# EAGLE design GPS Shield 2.0 (EAGLE 5.11)
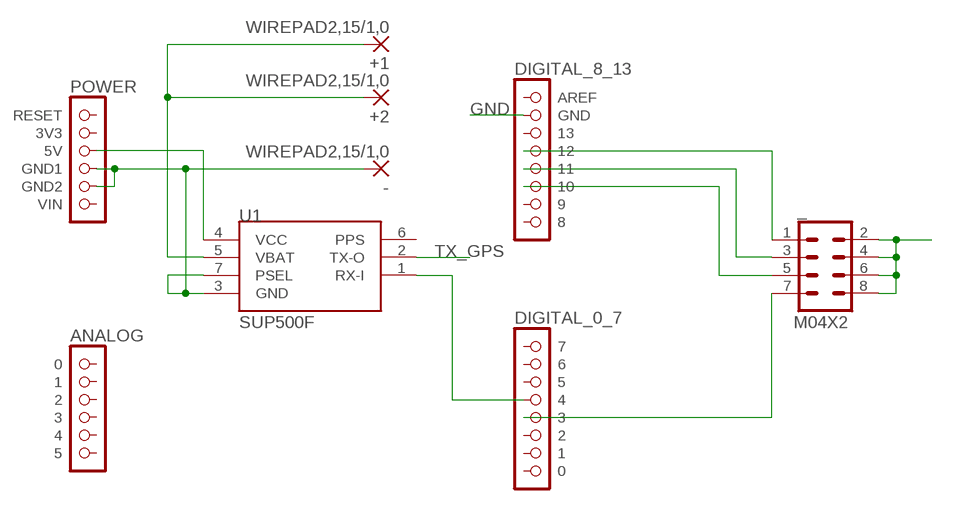
[diagram p0: schematic, sheet 1]

## Parts
+1  WIREPAD2,15/1,0  [2,15/1,0]
+2  WIREPAD2,15/1,0  [2,15/1,0]
-  WIREPAD2,15/1,0  [2,15/1,0]
_  M04X2  [2X4]
U1  SUP500F  [SUP500F]
U$1  POWER  [1X06]
U$2  ANALOG  [1X06]
U$3  DIGITAL_0_7  [1X08]
U$4  DIGITAL_8_13  [1X08]

## Nets
5V: U1.4(VCC) U$1.3(5V)
GND: -.1(P) U1.3(GND) U1.7(PSEL) U$1.4(GND1) U$1.5(GND2) U$4.2(GND)
N$2: U1.1(RX-I) U$3.4
N$5: +1.1(P) +2.1(P) U1.5(VBAT)
TO3: _.7 U$3.5
TO10: _.5 U$4.6
TO11: _.3 U$4.5
TO12: _.1 U$4.4
TX_GPS: _.2 _.4 _.6 _.8 U1.2(TX-O)
Unconnected: U1.6(PPS) U$1.1(RESET) U$1.2(3V3) U$1.6(VIN) U$2.1 U$2.2 U$2.3 U$2.4 U$2.5 U$2.6 U$3.1 U$3.2 U$3.3 U$3.6 U$3.7 U$3.8 U$4.1(AREF) U$4.3 U$4.7 U$4.8

## Library data of the parts
+1 +2 - = wirepad:WIREPAD: Wire PAD connect wire on PCB
_ = SparkFun-f115009:M04X2
U1 = SparkFun:SUP500F: SUP500F Venus GPS
U$1 = arduino:POWER
U$2 = arduino:ANALOG
U$3 = arduino:DIGITAL_0_7
U$4 = arduino:DIGITAL_8_13

## Board
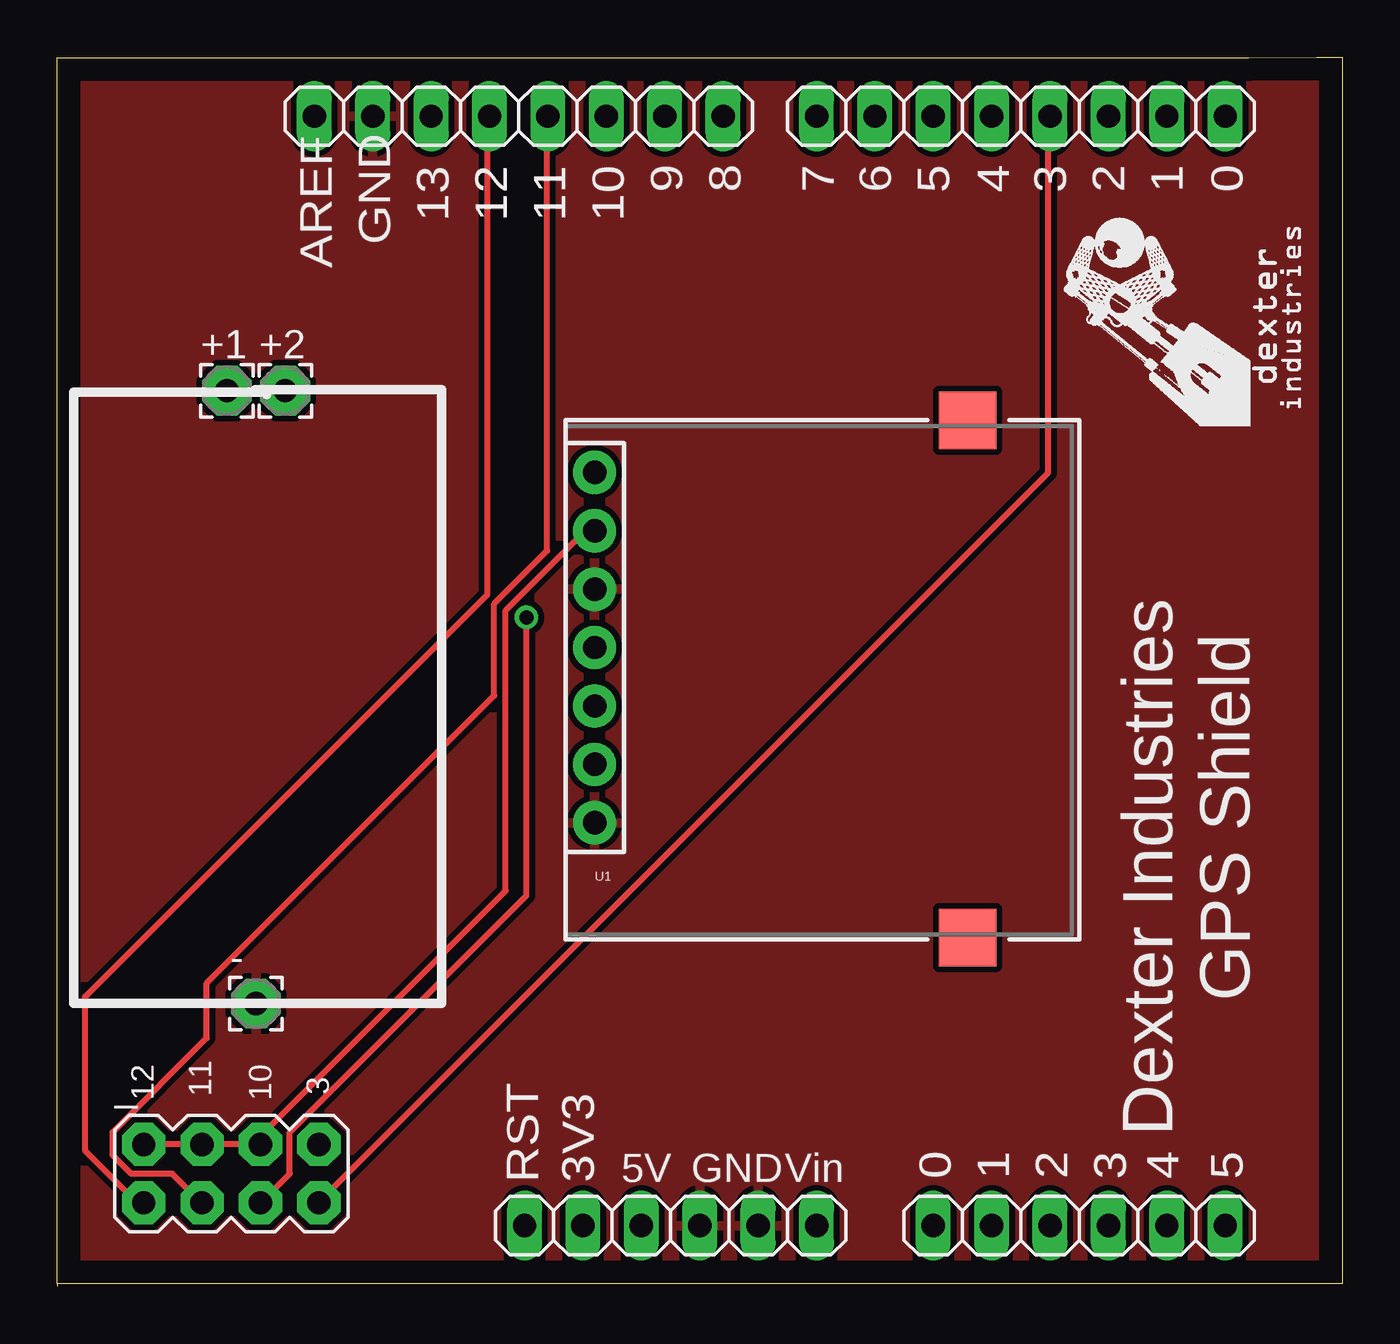
[diagram p1: board, top side]
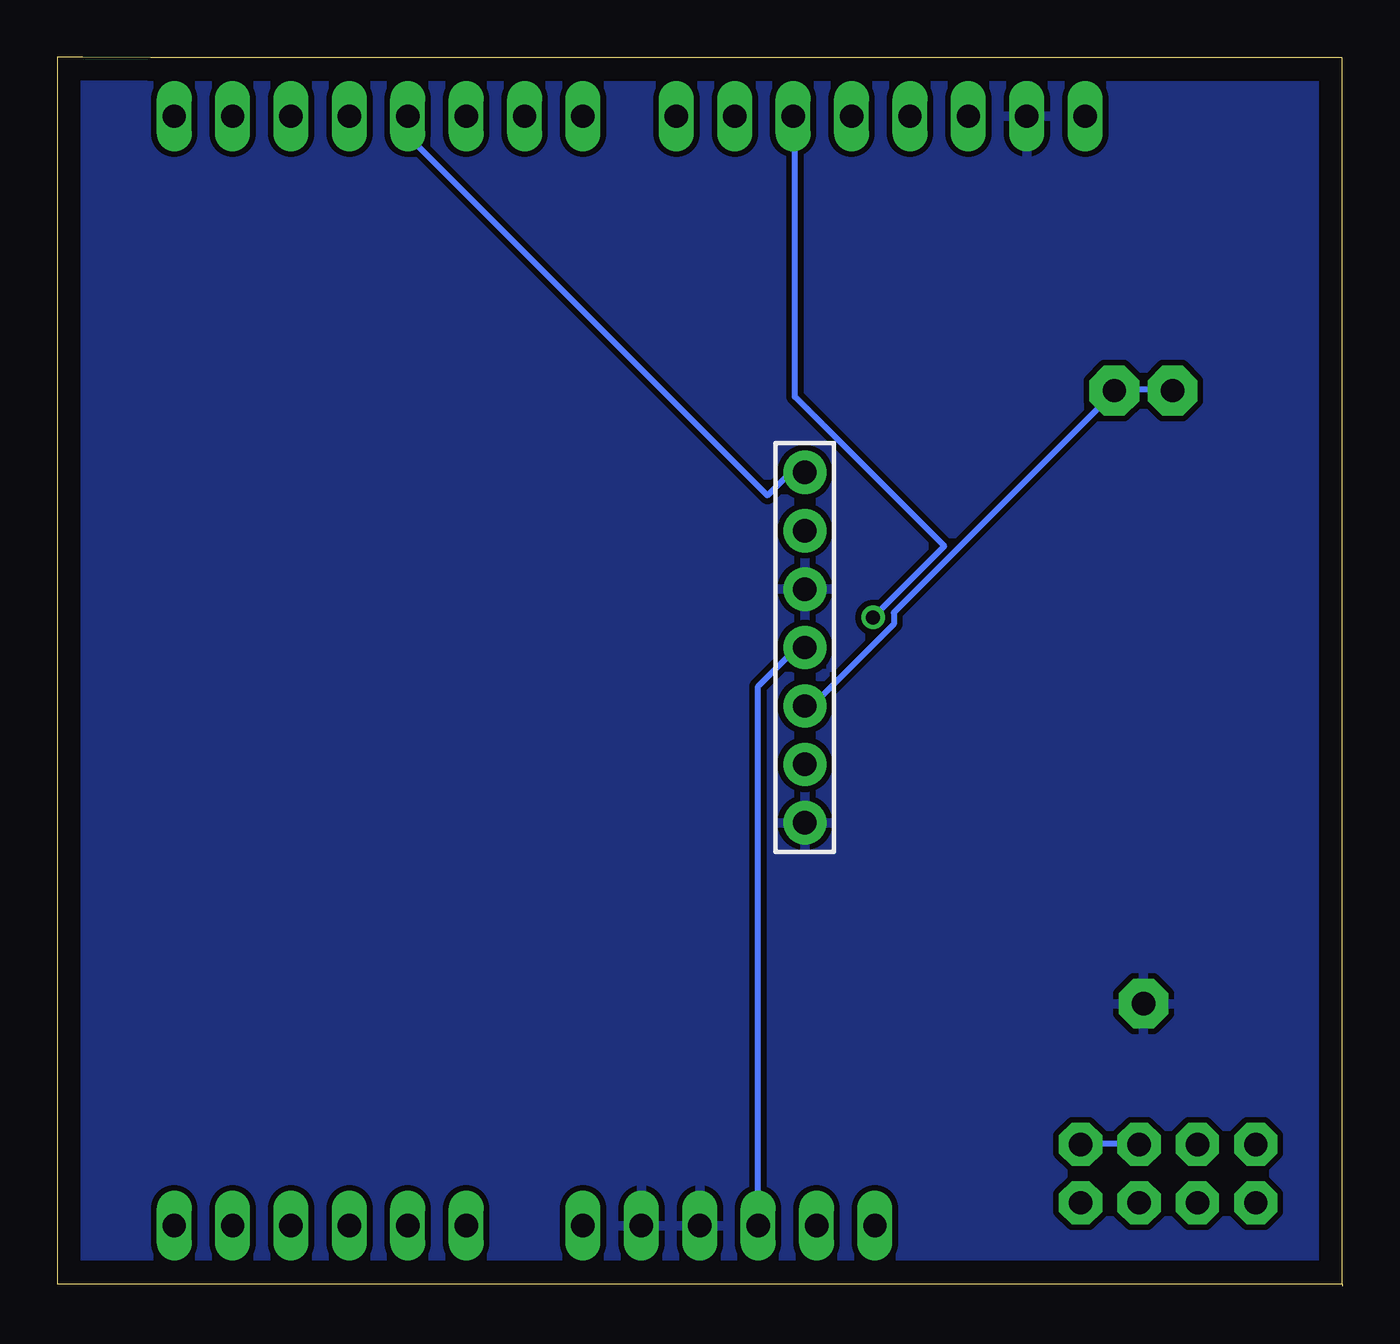
[diagram p2: board, bottom side, seen from below]

Size 55.88 x 53.46 mm. Coordinates in mm from the lower left corner, seen from the top.
Outline: 0,53.34 0,53.44
Outline: 0,53.44 51.82,53.44 54.78,53.46 55.88,53.46 55.88,0.1 0,0.1
Outline: 0,0.1 0,0
Outline: 0,0.1 0,53.34
Outline: 0,0.1 0,53.34
Outline: 0,53.34 0,53.44
Copper layers (1*16): Top 0.035mm / dielectric 1.5mm / Bottom 0.035mm
Design rules "default": minimum track width 10mil, minimum drill 24mil, track to track 8mil, track to pad 8mil, pad to pad 8mil, via to via 8mil, smd to smd 8mil, copper to edge 40mil, drill to drill 8mil, minimum pad ring 10mil, minimum via ring 8mil, stop-mask expansion 4mil, vias tented up to drill 0mil, thermal gap 10mil

### Footprints (pad centres in the part's own frame; a part is rotated, then mirrored left to right if it is on the bottom)
2,15/1,0 = drill 1.016 pad 2.159 octagon: 1 0,0
2X4 = drill 1.016 pad 1.88 octagon: 1 -3.81,-1.27; 2 -3.81,1.27; 3 -1.27,-1.27; 4 -1.27,1.27; 5 1.27,-1.27; 6 1.27,1.27; 7 3.81,-1.27; 8 3.81,1.27
SUP500F = drill 1.016 pad 1.88 round: 1 0,15.24; 2 0,12.7; 3 0,10.16; 4 0,7.62; 5 0,5.08; 6 0,2.54; 7 0,0 | smd 2.5 x 2.5: NC@0 16.22,-5; NC@1 16.22,17.51
1X06 = drill 1.016 long: 1 -6.35,0; 2 -3.81,0; 3 -1.27,0; 4 1.27,0; 5 3.81,0; 6 6.35,0
1X08 = drill 1.016 long: 1 -8.89,0; 2 -6.35,0; 3 -3.81,0; 4 -1.27,0; 5 1.27,0; 6 3.81,0; 7 6.35,0; 8 8.89,0

### Placement (x,y rotation side)
+1  7.37,38.96 0 top
+2  9.91,38.96 0 top
-  8.64,12.29 0 top
_  7.56,4.9 0 top
U1  23.37,20.17 0 top
U$1  26.67,2.64 0 top
U$2  44.45,2.64 0 top
U$3  41.91,50.9 0 top
U$4  20.07,50.9 0 top

### Tracks (layer width: path | path; a pad name or v marks a point on that pad's centre or on a via)
5V
  Bottom 0.254: U$1.3 25.4,26.1 24.1,27.4 23.7,27.4 23.4,27.7 U1.4
GND
  pour Bottom (isolate 0.254): 0.86,53.15 55.52,53.14 55.52,0.3 0.51,0.3 0.51,53.14
  pour Top (isolate 0.254): 0.69,52.87 55.36,52.87 55.36,0.48 0.69,0.48 0.69,51.74
N$2
  Bottom 0.254: U$3.4 40.6,50.9 40.6,50 25,34.4 24.2,35.2 23.6,35.2 23.4,35.4 U1.1
N$5
  Bottom 0.254: U1.5 23.3,25.3 23,25.3 19.5,28.8 19.5,29.3 9.9,38.9 +2.1 9.8,39 7.4,39 +1.1
TO3
  Top 0.254: U$3.5 43.1,50.9 43.1,35.4 11.4,3.7 _.7
TO10  (via drill 0.61)
  Top 0.254: v20.4,29.1 20.4,17 10.1,6.7 10.1,4.9 _.5
  Bottom 0.254: v20.4,29.1 17.3,32.2 23.8,38.7 23.8,50.9 U$4.6
TO11
  Top 0.254: U$4.5 21.3,50.9 21.3,32 19,29.7 19,25.7 6.5,13.2 6.5,10.8 2.4,6.7 2.4,5.7 3.2,4.9 5,4.9 6.2,3.7 _.3
TO12
  Top 0.254: U$4.4 18.7,50.9 18.7,30.1 1.2,12.6 1.2,5.9 3.6,3.5 3.7,3.6 _.1
TX_GPS
  Top 0.254: _.2 3.8,6.2 6.2,6.2 _.4 6.4,6.2 8.8,6.2 _.6 8.6,6.3 19.5,17.2 19.5,29.4 22.9,32.8 23.3,32.8 U1.2
  Bottom 0.254: _.8 11.3,6.2 8.9,6.2 _.6

### Text on the board
tPlace: GPS Shield | Dexter Industries
tNames: 9 | 8 | 7 | 6 | 5 | 4 | 3 | 2 | 1 | 0 | 13 | 12 | 11 | 10 | GND | AREF | C:/Users/John/Desktop/Dexter Industries/Projects/Arduino/01 GPS Shield/LOGO Square copy - BW BMP.bmp | 12 | 11 | 10 | 3 | 0 | 1 | 2 | 3 | 4 | 5 | RST | 3V3 | 5V | GND | Vin
ArduinoHoles: 3.2mm | 2.2mm | 3.2mm